# EAGLE schematic lm2576-adj_powersupply (EAGLE 7.2.0)
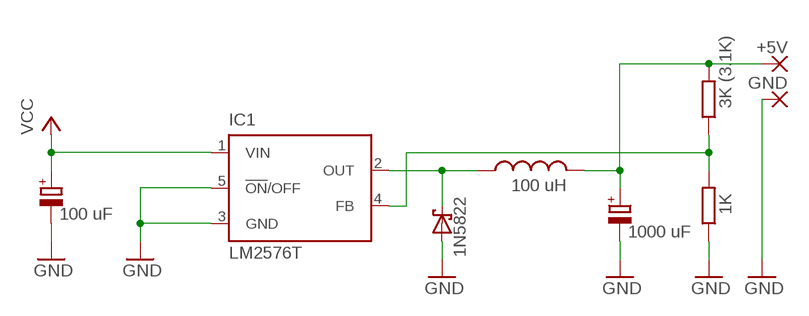
[diagram p0: schematic, sheet 1]

## Parts
+5V  2,15/1,0  [2,15/1,0]
C1  100 uF  CPOL-EUE7.5-16  [E7,5-16]
C2  1000 uF  CPOL-EUE7.5-16  [E7,5-16]
D1  1N5822  1N5908  [C4111-15]
GND  GND  2,15/1,0  [2,15/1,0]
IC1  LM2576T  LM2596T  [T05D]
L1  100 uH  L-US6000-XXX-RC  [6000-XXXX-RC]
R1  1K  R-EU_0207/10  [0207/10]
R2  3K (3.1K)  R-EU_0207/10  [0207/10]

## Nets
GND: C1.- C2.- D1.A GND.1(P) IC1.3(GND) IC1.5(!ON!/OFF) R1.1
N$1: D1.C IC1.2(OUT) L1.1
N$2: +5V.1(P) C2.+ L1.2 R2.2
N$3: IC1.4(FB) R1.2 R2.1
VCC: C1.+ IC1.1(VIN)

## Library data of the parts
+5V GND = wirepad:2,15/1,0: THROUGH-HOLE PAD
C1 C2 = resistor:CPOL-EU: POLARIZED CAPACITOR, European symbol
D1 = diode:1N5908: DIODE schottky
IC1 = national-semiconductor:LM2596: SIMPLE SWITCHER® Power Converter 150 kHz 3A Step-Down Voltage Regulator Source: http://www.national.com/ds/LM/LM2596.pdf; MPN: LM2576T-ADJ; OC_FARNELL: 9494162; OC_NEWARK: 65K5910
L1 = rcl:L-US: INDUCTOR, American symbol
R1 R2 = rcl:R-EU_: RESISTOR, European symbol